# EAGLE design amc7135-by-4-15mm-led-aux-driver-mk-1.0 (EAGLE 7.5.0)
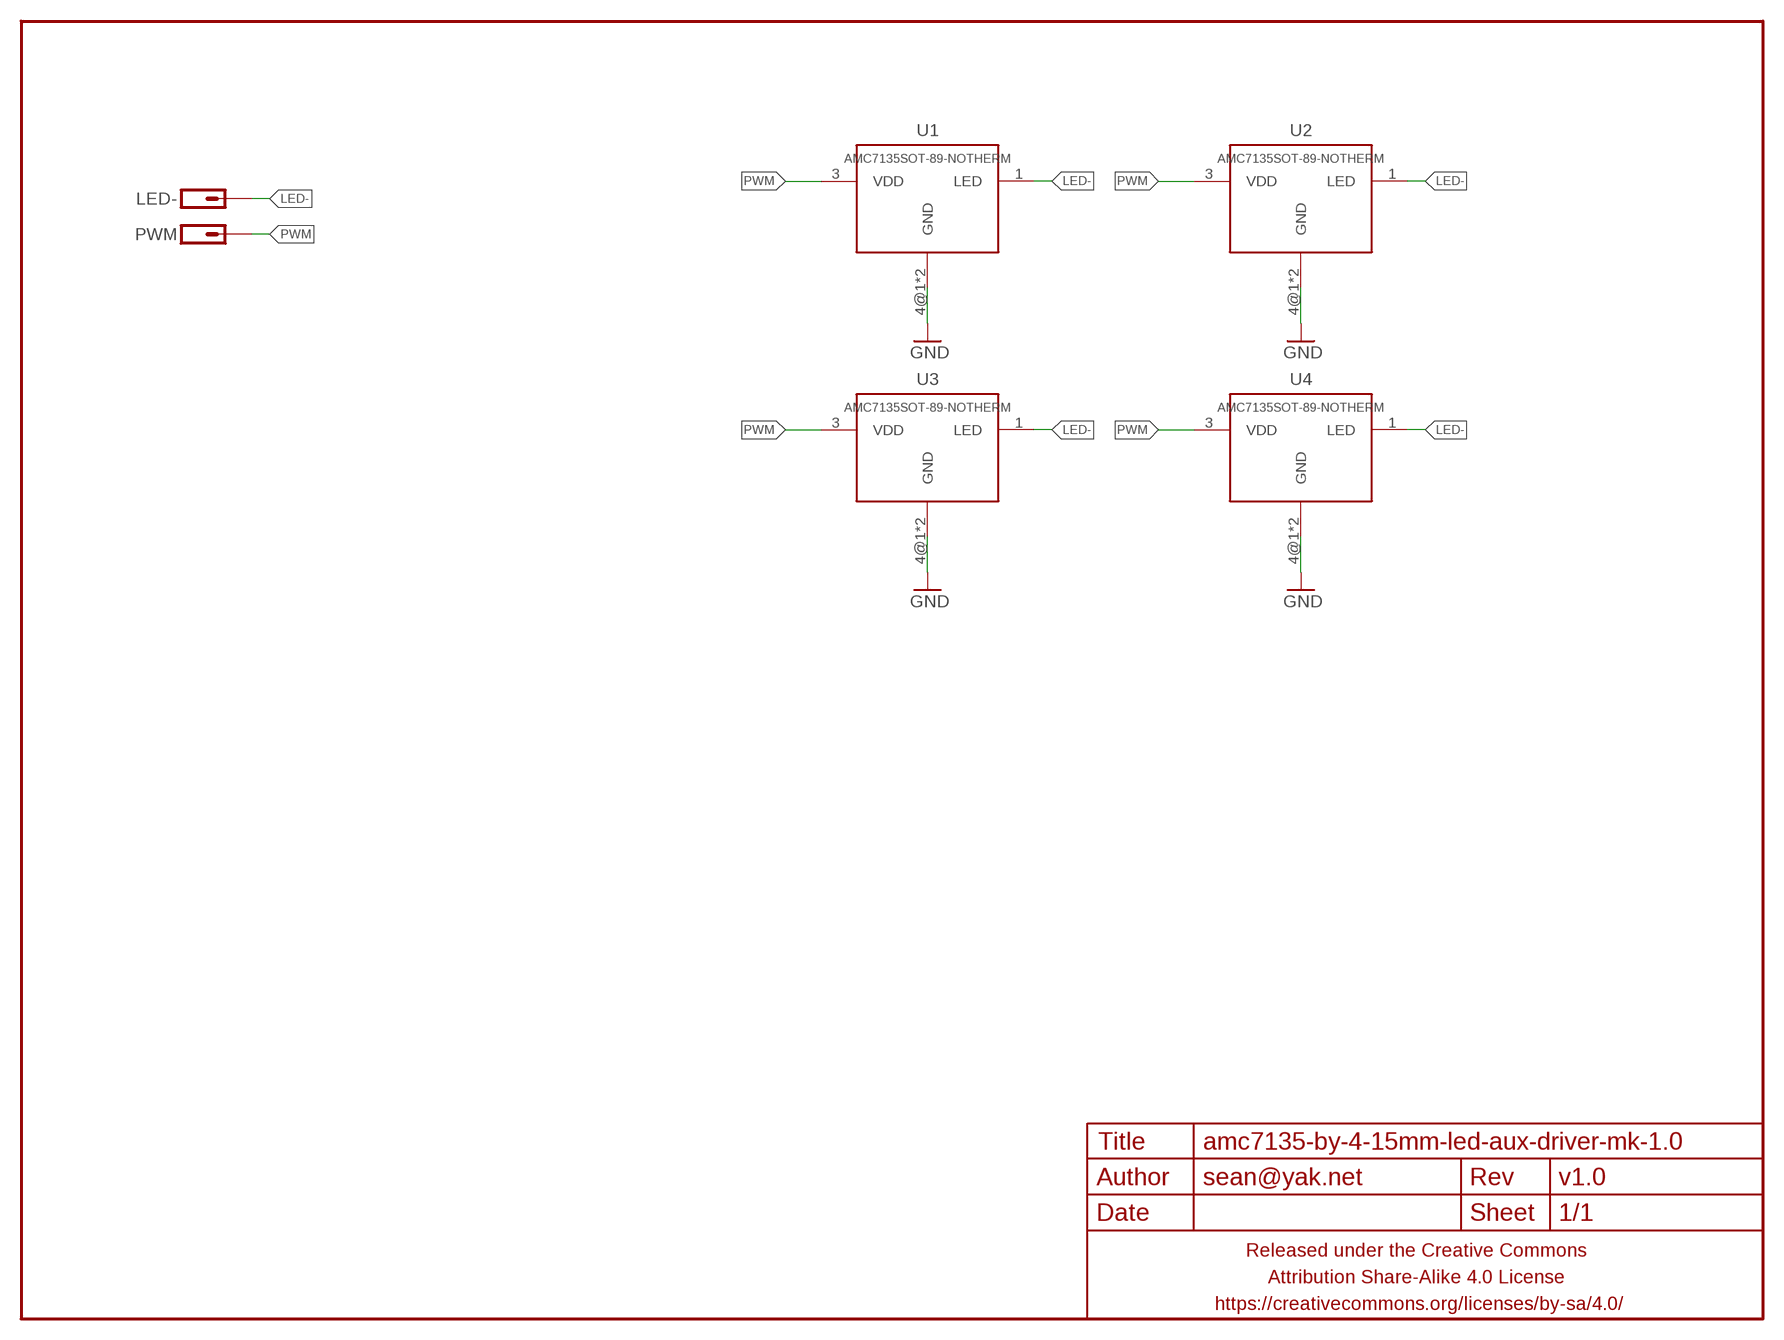
[diagram p0: schematic, sheet 1]

## Parts
FRAME1  FRAME-LETTERNO_PACKAGE  [DUMMY]
LED-  M01SMD-1.25MM-DIA  [1X01-SMD-1.25MM-DIA-NS]
PWM  M01SMD-1.25MM-DIA  [1X01-SMD-1.25MM-DIA-NS]
U1  AMC7135SOT-89-NOTHERM  [SOT89-NOTHERM]
U2  AMC7135SOT-89-NOTHERM  [SOT89-NOTHERM]
U3  AMC7135SOT-89-NOTHERM  [SOT89-NOTHERM]
U4  AMC7135SOT-89-NOTHERM  [SOT89-NOTHERM]

## Nets
GND: U1.4@1(GND) U1.4@2(GND) U2.4@1(GND) U2.4@2(GND) U3.4@1(GND) U3.4@2(GND) U4.4@1(GND) U4.4@2(GND)
LED-: LED-.P$1 U1.1(LED) U2.1(LED) U3.1(LED) U4.1(LED)
PWM: PWM.P$1 U1.3(VDD) U2.3(VDD) U3.3(VDD) U4.3(VDD)

## Library data of the parts
FRAME1 = a_parts:FRAME-LETTER: Schematic Frame Standard 8.5x11 US Letter frame; DESIGNER: sean@yak.net; VERSION: v1.0
LED- PWM = a_parts:M01: Header 1 Standard 1-pin 0.1" header. Use with straight break away headers (SKU : PRT-00116), right angle break away headers (PRT-00553), swiss pins (PRT-00743), machine pins (PRT-00117), and female headers (PRT-00115).
U1-U4 = a_parts:AMC7135

## Board
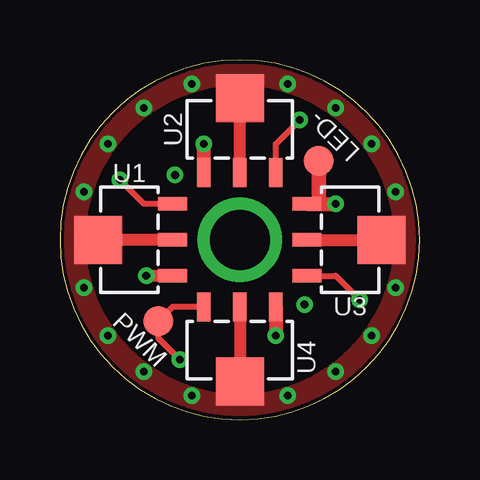
[diagram p1: board, top side]
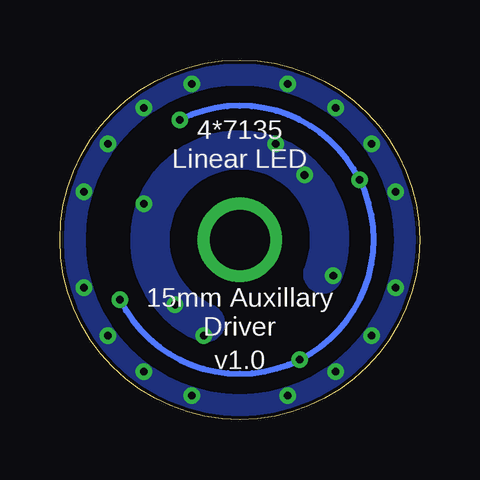
[diagram p2: board, bottom side, seen from below]

Size 15 x 15 mm. Coordinates in mm from the lower left corner, seen from the top.
Outline: 0,7.5 arc180 15,7.5 arc180 0,7.5
Copper layers (1*16): Top 0.0356mm / dielectric 1.5011mm / Bottom 0.0356mm
Design rules "LaenPCBOrder2": minimum track width 6mil, minimum drill 13mil, track to track 6mil, track to pad 6mil, pad to pad 6mil, via to via 6mil, smd to smd 6mil, copper to edge 6mil, drill to drill 6mil, minimum pad ring 7mil, minimum via ring 7mil, stop-mask expansion 3mil, vias tented up to drill 20mil, thermal gap 10mil

### Footprints (pad centres in the part's own frame; a part is rotated, then mirrored left to right if it is on the bottom)
1X01-SMD-1.25MM-DIA-NS = smd 1.25 x 1.25: P$1 0,0
SOT89-NOTHERM = smd 0.58 x 1.2: 1 -1.5,-1.8; 3 1.5,-1.8; 4@1 0,-1.8 | smd 2 x 2: 4@2 0,1.3

### Placement (x,y rotation side)
FRAME1  0,0 0 top
LED-  10.8,10.8 0 top
PWM  4.1,4.1 0 top
U1  2.9,7.5 90 top
U2  7.5,12.1 0 top
U3  12.1,7.5 270 top
U4  7.5,2.9 180 top

### Tracks (layer width: path | path; a pad name or v marks a point on that pad's centre or on a via)
GND  (via drill 0.33)
  Top 0.5: U1.4@1 U1.4@2 | U2.4@1 U2.4@2 | U3.4@1 U3.4@2 | U4.4@1 U4.4@2
  other vias: 9.5,1 14,5.5 14,9.5 5.5,1 1,5.5 1,9.5 5.5,14 9.5,14 11.5,13 13,11.5 2,11.5 3.5,13 2,3.5 3.5,2 13,3.5 11.5,2
  pour Top (isolate 0.152, rank 6, no thermals): 0,7.5 arc180 15,7.5 14,7.5 arc-180 1,7.5
  pour Top (isolate 0.152, rank 6, no thermals): 15,7.5 arc180 0,7.5 1,7.5 arc-180 14,7.5
  pour Bottom (isolate 0.152, rank 6, no thermals): 15,7.5 arc180 0,7.5 1,7.5 arc-180 14,7.5
  pour Bottom (isolate 0.152, rank 6, no thermals): 0,7.5 arc180 15,7.5 14,7.5 arc-180 1,7.5
LED-  (via drill 0.33)
  Top 0.5: U1.1 v3.6,6
  Top 0.575: U2.1 v6,11.5 | U3.1 10.7,9 v11.5,9 | U4.1 v9,3.5
  Top 0.6: LED-.P$1 10.8,9.1 10.7,9
  other vias: 10.2,4.8 4.8,10.2
  pour Bottom (isolate 0.152, no thermals): 9.22,3.34 arc-180 8.65,4.73 arc90 10.27,8.65 11.66,9.22 arc-90
  pour Bottom (isolate 0.152, no thermals): 11.66,9.22 10.27,8.65 arc90 6.35,10.27 5.78,11.66 arc-90
  pour Bottom (isolate 0.152, no thermals): 5.78,11.66 6.35,10.27 arc90 4.73,6.35 arc-180 3.34,5.78 arc-90
N$1  (via drill 2.5)
  other vias: 7.5,7.5
PWM  (via drill 0.33)
  Top 0.25: U4.3 4.7,4.7 PWM.P$1 4.1,3.4 v5,2.5 | U2.3 9,11.5 v10,12.5 | U3.3 11.5,6 v12.5,5 | U1.3 3.5,9 v2.5,10
  Bottom 0.25: v10,12.5 arc90 v2.5,10 arc90 v5,2.5 arc90 v12.5,5

### Text on the board
bPlace: 4*7135 / Linear LED | 15mm Auxillary / Driver